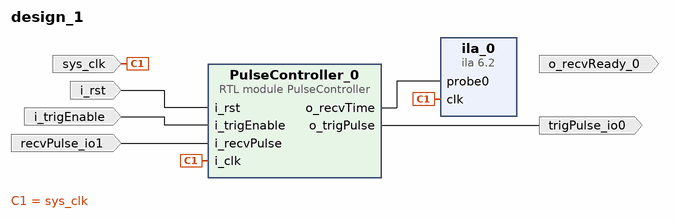
[diagram p0: block diagram of the top level]
# Vivado block design design_1, xc7z010clg400-1, Vivado 2023.1
create_bd_design design_1

create_bd_port -dir I -type clk sys_clk
create_bd_port -dir I -type rst i_rst
create_bd_port -dir I i_trigEnable
create_bd_port -dir O trigPulse_io0
create_bd_port -dir I recvPulse_io1
create_bd_port -dir O o_recvReady_0

create_bd_cell -type ip -vlnv xilinx.com:ip:ila:6.2 ila_0
set_property -dict {CONFIG.C_MONITOR_TYPE Native CONFIG.C_PROBE0_WIDTH 8} [get_bd_cells ila_0]
create_bd_cell -type module -reference PulseController PulseController_0

# ---- connections ----

# net PulseController_0_o_recvReady has one end: o_recvReady_0
connect_bd_net [get_bd_pins PulseController_0/o_recvTime] [get_bd_pins ila_0/probe0]
connect_bd_net [get_bd_pins PulseController_0/o_trigPulse] [get_bd_ports trigPulse_io0]
connect_bd_net -net clk_wiz_0_clk_out1 [get_bd_ports sys_clk] [get_bd_pins ila_0/clk] [get_bd_pins PulseController_0/i_clk]
connect_bd_net -net i_rst_0_1 [get_bd_ports i_rst] [get_bd_pins PulseController_0/i_rst]
connect_bd_net -net i_trigEnable_0_1 [get_bd_ports i_trigEnable] [get_bd_pins PulseController_0/i_trigEnable]
connect_bd_net -net recvPulse_io1_1 [get_bd_ports recvPulse_io1] [get_bd_pins PulseController_0/i_recvPulse]

validate_bd_design
save_bd_design
